# Altium schematic sheet electronic_dc_load_v1.SchDoc: Electronic DC Load (part 2 of 3)
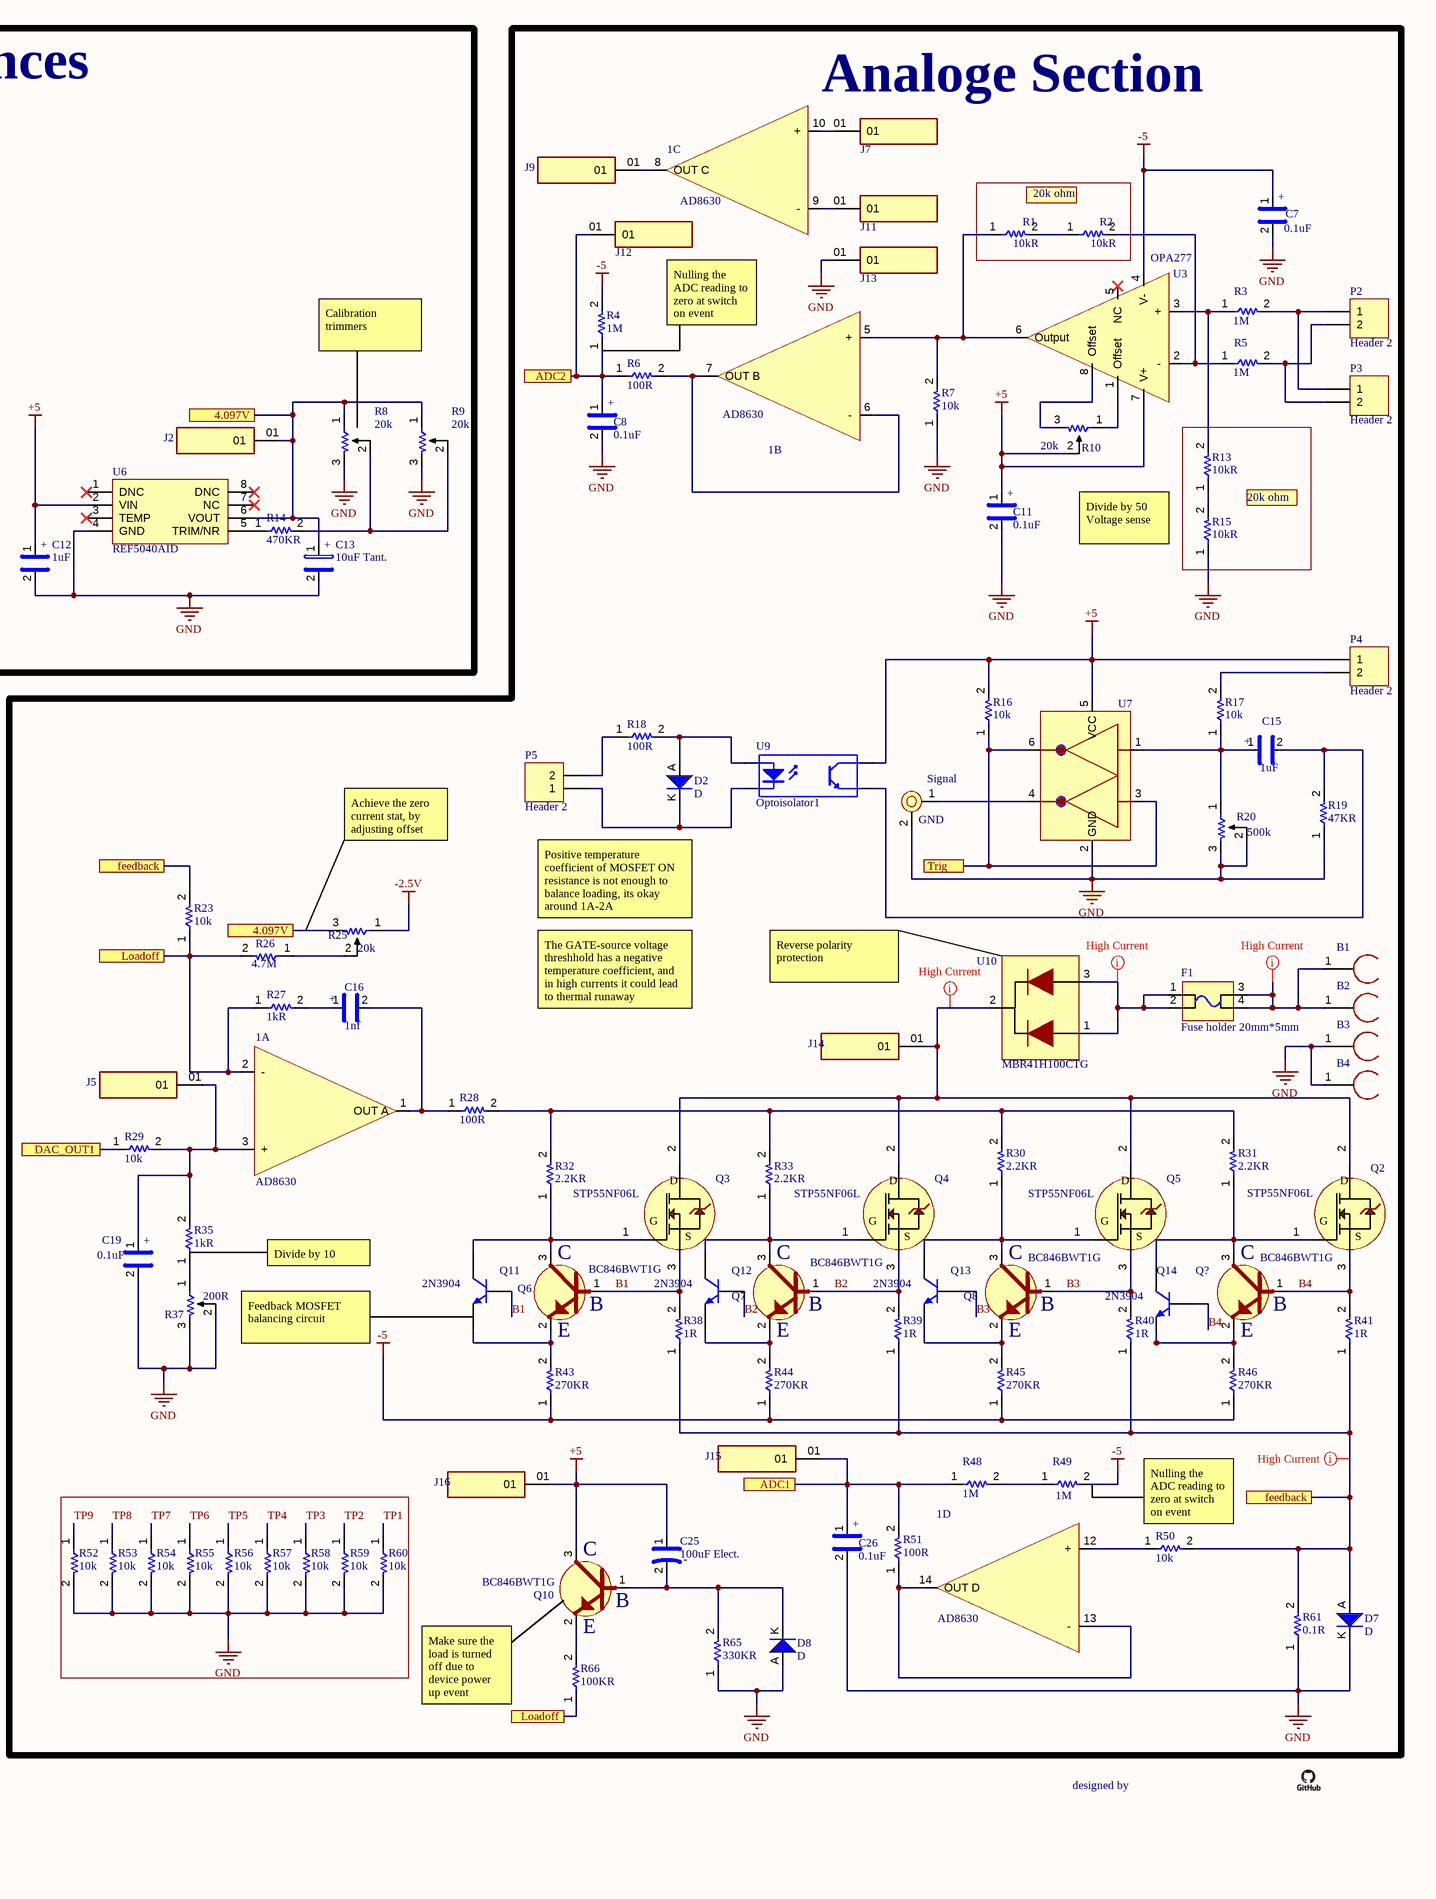
[diagram p2: electronic_dc_load_v1.SchDoc, right]
## Library data of the parts
1 = AD8630: ANALOG DEVICES - AD8630ARUZ - Operational Amplifier, Quad, 4 Amplifier, 2.5 MHz, 1 V/µs, 2.7V to 5V, TSSOP, 14 Pins; Gain Bandwidth Product: 2.5MHz; Max Dual Supply Voltage: 2.5V; Min Dual Supply Voltage: 1.35V; Voltage Gain: 145dB; Number of Channels: 4; Common Mode Rejection Ratio: 140dB; Slew Rate: 1V/µs; Input Bias Current: 100pA; Input Offset Voltage (Vos): 2.5uV; Operating Supply Current: 4.4mA; Output Current per Channel: 30mA; Power Supply Rejection Ratio (PSRR): 130dB; Operating Supply Voltage: 3V; Quiescent Current: 1.1mA; Input Capacitance: 10pF; Supplier 1: Newark; Manufacturer: Analog Devices; Manufacturer Part Number: AD8630ARUZ; RoHS: Yes; Category: Amplifiers - Op Amps, Buffer, Instrumentation; Case/Package: TSSOP; Number of Pins: 14; Contact Plating: Tin,Matte; Min Operating Temperature: -40°C; Max Operating Temperature: 125°C; Min Supply Voltage: 2.7V; Max Supply Voltage: 5V; Unity Gain Bandwidth Product: 2.5MHz; Packaging: Rail/Tube; Package Quantity: 96; Number of Circuits: 4; Number of Elements: 4; Number of Amplifiers: 4; -3db Bandwidth: 2.5MHz; Series: -; Bandwidth: 2.5MHz; Max Supply Current: 4.4mA; Length: 5mm; Width: 4.4mm; Height: 1mm; Radiation Hardening: No; Lead Free: Contains Lead; RoHS Compliant: Yes; REACH SVHC: No SVHC; ComponentLink1URL: https://datasheet.ciiva.com/15130/getdatasheetpartid-63998-15130068.pdf?src-supplier=Verical; ComponentLink1Description: https://datasheet.ciiva.com/15130/getdatasheetpartid-63998-15130068.pdf?src-supplier=Verical; ComponentLink2URL: https://datasheet.ciiva.com/26849/ad8630aruz-26849452.pdf?src-supplier=IIIC; ComponentLink2Description: https://datasheet.ciiva.com/26849/ad8630aruz-26849452.pdf?src-supplier=IIIC; ComponentLink3URL: https://datasheet.ciiva.com/1795/ad8628-8629-8630-1795026.pdf?src-supplier=Digi-Key; ComponentLink3Description: https://datasheet.ciiva.com/1795/ad8628-8629-8630-1795026.pdf?src-supplier=Digi-Key; ComponentLink4URL: https://datasheet.ciiva.com/2976/ad8628-8629-8630-2976039.pdf?src-supplier=Avnet; ComponentLink4Description: https://datasheet.ciiva.com/2976/ad8628-8629-8630-2976039.pdf?src-supplier=Avnet; ComponentLink5URL: https://datasheet.ciiva.com/15374/ad8628-8629-8630-249176-15374283.pdf?src-supplier=Mouser; ComponentLink5Description: https://datasheet.ciiva.com/15374/ad8628-8629-8630-249176-15374283.pdf?src-supplier=Mouser; ComponentLink6URL: https://datasheet.ciiva.com/1135/1852416-1135902.pdf?src-supplier=Element14; ComponentLink6Description: https://datasheet.ciiva.com/1135/1852416-1135902.pdf?src-supplier=Element14; ComponentLink7URL: https://datasheet.ciiva.com/48710/001249419-da-01-en-ic-opamp-chopper-ad8630aruz-tssop-14-adi-48710044.pdf?src-supplier=Conrad; ComponentLink7Description: https://datasheet.ciiva.com/48710/001249419-da-01-en-ic-opamp-chopper-ad8630aruz-tssop-14-adi-48710044.pdf?src-supplier=Conrad; Supplier Part Number 1: 19M0982
4 = 031-71052: Connector; RF; BNC; Rt. Angle; PCB Jack; Bulkhead Mnt; 75 Ohm; Nickel/Gold; Manufacturer: Amphenol; Body Material: Zinc; Body Plating: Nickel; Dielectric Material: PBT; Frequency: 1GHz; Impedance: 75R; Connector Type: BNC,Socket; Voltage Rating: 500V; Supplier 1: Digi-Key; Manufacturer Part Number: 031-71052; RoHS: Yes; Category: RF / Coaxial Connectors; Stock 1: 160; Pricing 1: 1=3.33000, 10=3.20000, 25=2.93320, 50=2.79980, 100=2.66640, 250=2.33312, 500=2.26644, 1000=1.93314, 2500=1.79982 (USD); Mount: Through Hole,Panel,Bulkhead,PCB; Contact Material: Bronze,Copper; Contact Plating: Gold; Housing Color: Silver; Min Operating Temperature: -55°C; Max Operating Temperature: 85°C; Termination: Solder; Packaging: Bulk; Orientation: Right Angle; Max Frequency: 1GHz; Package Quantity: 100; Fastening Type: Bayonet; Radiation Hardening: No; ComponentLink1URL: https://datasheet.ciiva.com/29191/c031-71052-29191970.pdf?src-supplier=Digi-Key; ComponentLink1Description: https://datasheet.ciiva.com/29191/c031-71052-29191970.pdf?src-supplier=Digi-Key; ComponentLink2URL: https://datasheet.ciiva.com/14568/70142399-14568714.pdf?src-supplier=Allied+Electronics; ComponentLink2Description: https://datasheet.ciiva.com/14568/70142399-14568714.pdf?src-supplier=Allied+Electronics; Supplier Part Number 1: ARF2869-ND
C1 = 47μF: 47μF 16V  electrolytic
C2 = 470μF: 35V electrolytic
C3-C5 C7-C9 C11 C17 C19 C26 = 0.1uF: CAPACITOR PEN FILM 0.1UF, 100V, 10%, 1812, FULL REEL; Product Range:AEC-Q200 LDE Series; Capacitance:0.1 F; Capacitance Tolerance: 10%; Capacitor Dielectric Type:PEN (Polyethylene Naphthalate); Voltage Rating:100V; Lead Spacing:- ;RoHS Compliant: Yes; Manufacturer: KEMET; Manufacturer Part Number: LDEEC3100KA5N00; Dielectric Material: Polyester; Capacitance: 100nF; Voltage Rating (AC): 63V; Dissipation Factor: 0.8%; Supplier 1: Digi-Key; RoHS: Yes; Category: Film Capacitors; Stock 1: 2950; Pricing 1: 1=0.88000, 10=0.66600, 50=0.55300, 100=0.47620, 500=0.36868, 1000=0.31747 (USD); Mount: Surface Mount,PCB; Case/Package: 1812; Number of Pins: 2; Case Code (Metric): 4532; Case Code (Imperial): 1812; Min Operating Temperature: -55°C; Max Operating Temperature: 125°C; Tolerance: 10%; Package Quantity: 1; Voltage Rating: 100V; Voltage Rating (DC): 100V; Packaging: Tape and Reel; Termination: SMD/SMT; Voltage: 100V; Series: LDE; Construction: Flat; Length: 4.7mm; Width: 3.2mm; Height: 2.4mm; Height - Seated (Max): 0.094inch; Depth: 3.3mm; Radiation Hardening: No; REACH SVHC: No SVHC; RoHS Compliant: Yes; ComponentLink1URL: https://datasheet.ciiva.com/17238/datasheetpn-ldeec3100ka5n00-17238771.pdf?src-supplier=Avnet+Europe; ComponentLink1Description: https://datasheet.ciiva.com/17238/datasheetpn-ldeec3100ka5n00-17238771.pdf?src-supplier=Avnet+Europe; Supplier Part Number 1: 399-5480-1-ND
C6 = 220μF: 220μF 25V  electrolytic
C10 C18 C20 C23-C25 = 100uF Elect.: CAP ALUM 100UF 20% 50V SMD electrolytic; Manufacturer: KEMET; Manufacturer Part Number: EDK107M050A9MAA; Ripple Current: 165mA; Leakage Current: 50uA; Life (Hours): 2000Hour; Dissipation Factor: 12%; Supplier 1: Digi-Key; RoHS: Yes; Category: Aluminum Electrolytic Capacitors; Stock 1: 2832; Pricing 1: 1=0.74000, 10=0.52100, 50=0.39420, 100=0.34340 (USD); Mount: Surface Mount; Case/Package: Radial; Min Operating Temperature: -40°C; Max Operating Temperature: 85°C; Capacitance: 100uF; Tolerance: 20%; Package Quantity: 500; Voltage Rating: 50V; Packaging: Cut Tape; Voltage Rating (DC): 50V; Ripple Current (AC): 165mA; Termination: SMD/SMT; Series: EDK; Construction: Cylindrical; Diameter: 8mm; Length: 10.2mm; Height: 10.2mm; Height - Seated (Max): 0.413inch; Radiation Hardening: No; REACH SVHC: No SVHC; RoHS Compliant: Yes; ComponentLink1URL: https://datasheet.ciiva.com/5363/kem-a4001-edk-535350-5363820.pdf?src-supplier=Mouser; ComponentLink1Description: https://datasheet.ciiva.com/5363/kem-a4001-edk-535350-5363820.pdf?src-supplier=Mouser; ComponentLink2URL: https://datasheet.ciiva.com/8032/1680956-8032398.pdf?src-supplier=Element14; ComponentLink2Description: https://datasheet.ciiva.com/8032/1680956-8032398.pdf?src-supplier=Element14; Supplier Part Number 1: 399-6672-1-ND
C12 C15 = 1uF: CAP TANT 1UF 35V 10% 1206; Manufacturer: Kyocera AVX; Manufacturer Part Number: TPSA105K035R3000; Dielectric Material: Tantalum; ESR (Equivalent Series Resistance): 3R; Ripple Current: 63uA; Leakage Current: 500nA; Polarity: Polar; Dissipation Factor: 4%; Supplier 1: Digi-Key; RoHS: Yes; Category: Tantalum Capacitors; Stock 1: 11457; Pricing 1: 1=0.57000, 10=0.40600, 50=0.30680, 100=0.26730, 500=0.19800, 1000=0.16830 (USD); Mount: Surface Mount,PCB; Case/Package: 1206; Number of Pins: 2; Case Code (Imperial): 1206; Case Code (Metric): 3216; Min Operating Temperature: -55°C; Max Operating Temperature: 125°C; Capacitance: 1uF; Package Quantity: 1; Voltage Rating: 35V; Tolerance: 10%; Packaging: Tape and Reel; Voltage Rating (DC): 35V; Termination: SMD/SMT; Voltage: 35V; Features: General Purpose; Series: TPS; Construction: Flat; Length: 3.2mm; Width: 1.6mm; Height: 1.6mm; Height - Seated (Max): 0.071inch; Depth: 1.6mm; Radiation Hardening: No; REACH SVHC: No SVHC; Lead Free: Lead Free; RoHS Compliant: Yes; ComponentLink1URL: https://datasheet.ciiva.com/11794/0900766b8070be5f-11794565.pdf?src-supplier=RSComponents; ComponentLink1Description: https://datasheet.ciiva.com/11794/0900766b8070be5f-11794565.pdf?src-supplier=RSComponents; ComponentLink2URL: https://datasheet.ciiva.com/263/tps-263817.pdf?src-supplier=Digi-Key; ComponentLink2Description: https://datasheet.ciiva.com/263/tps-263817.pdf?src-supplier=Digi-Key; ComponentLink3URL: https://datasheet.ciiva.com/7832/1680477-7832618.pdf?src-supplier=Element14; ComponentLink3Description: https://datasheet.ciiva.com/7832/1680477-7832618.pdf?src-supplier=Element14; ComponentLink4URL: https://datasheet.ciiva.com/7832/1441576-7832619.pdf?src-supplier=Element14; ComponentLink4Description: https://datasheet.ciiva.com/7832/1441576-7832619.pdf?src-supplier=Element14; ComponentLink5URL: https://datasheet.ciiva.com/7832/1441576-7832620.pdf?src-supplier=Element14; ComponentLink5Description: https://datasheet.ciiva.com/7832/1441576-7832620.pdf?src-supplier=Element14; ComponentLink6URL: https://datasheet.ciiva.com/14602/70001047-14602621.pdf?src-supplier=Allied+Electronics; ComponentLink6Description: https://datasheet.ciiva.com/14602/70001047-14602621.pdf?src-supplier=Allied+Electronics; ComponentLink7URL: https://datasheet.ciiva.com/14598/70001047-14598933.pdf?src-supplier=Allied+Electronics; ComponentLink7Description: https://datasheet.ciiva.com/14598/70001047-14598933.pdf?src-supplier=Allied+Electronics; ComponentLink8URL: https://datasheet.ciiva.com/263/tps-263816.pdf?src-supplier=Digi-Key; ComponentLink8Description: https://datasheet.ciiva.com/263/tps-263816.pdf?src-supplier=Digi-Key; ComponentLink9URL: https://datasheet.ciiva.com/263/tps-263818.pdf?src-supplier=Digi-Key; ComponentLink9Description: https://datasheet.ciiva.com/263/tps-263818.pdf?src-supplier=Digi-Key; ComponentLink10URL: https://datasheet.ciiva.com/46438/packmark-46438479.pdf?src-supplier=Element14; ComponentLink10Description: https://datasheet.ciiva.com/46438/packmark-46438479.pdf?src-supplier=Element14; Supplier Part Number 1: 478-3336-1-ND
C13 = 10uF Tant.: AVX   TPSC106K025R0500...   CAPACITOR, CASE C, 10UF, 25V; Manufacturer: Kyocera AVX; Dielectric Material: Tantalum; Tolerance: 10%; ESR (Equivalent Series Resistance): 500mR; Leakage Current: 2.5uA; Dissipation Factor: 6%; Polarity: Polar; Supplier 1: Digi-Key; Manufacturer Part Number: TPSC106K025R0500; RoHS: Yes; Category: Tantalum Capacitors; Stock 1: 8068; Pricing 1: 1=0.88000, 10=0.66600, 50=0.55360, 100=0.47660 (USD); Mount: Surface Mount,PCB; Case/Package: Molded; Number of Pins: 2; Case Code (Imperial): 2312; Case Code (Metric): 6032; Min Operating Temperature: -55°C; Max Operating Temperature: 125°C; Capacitance: 10uF; Packaging: Tape and Reel; Voltage Rating: 25V; Voltage Rating (DC): 25V; Package Quantity: 1; Termination: SMD/SMT; Voltage: 25V; Features: General Purpose; Series: TPS; Construction: Flat; Length: 6mm; Width: 3.2mm; Height: 2.6mm; Height - Seated (Max): 0.11inch; Depth: 3.2mm; Size: 2.6mm; Radiation Hardening: No; REACH SVHC: No SVHC; Lead Free: Lead Free; RoHS Compliant: Yes; ComponentLink1URL: https://datasheet.ciiva.com/19458/2025244-19458872.pdf?src-supplier=Jameco; ComponentLink1Description: https://datasheet.ciiva.com/19458/2025244-19458872.pdf?src-supplier=Jameco; ComponentLink2URL: https://datasheet.ciiva.com/29121/806610-da-01-en-smd-tantal10uf-25v-10-0-500r-500st-29121571.pdf?src-supplier=Conrad; ComponentLink2Description: https://datasheet.ciiva.com/29121/806610-da-01-en-smd-tantal10uf-25v-10-0-500r-500st-29121571.pdf?src-supplier=Conrad; ComponentLink3URL: https://datasheet.ciiva.com/12911/tps-23028-12911431.pdf?src-supplier=Mouser; ComponentLink3Description: https://datasheet.ciiva.com/12911/tps-23028-12911431.pdf?src-supplier=Mouser; ComponentLink4URL: https://datasheet.ciiva.com/7730/1441576-7730890.pdf?src-supplier=Element14; ComponentLink4Description: https://datasheet.ciiva.com/7730/1441576-7730890.pdf?src-supplier=Element14; ComponentLink5URL: https://datasheet.ciiva.com/7730/1755837-7730891.pdf?src-supplier=Element14; ComponentLink5Description: https://datasheet.ciiva.com/7730/1755837-7730891.pdf?src-supplier=Element14; ComponentLink6URL: https://datasheet.ciiva.com/264/tps-264284.pdf?src-supplier=Digi-Key; ComponentLink6Description: https://datasheet.ciiva.com/264/tps-264284.pdf?src-supplier=Digi-Key; ComponentLink7URL: https://datasheet.ciiva.com/7730/1755837-7730892.pdf?src-supplier=Element14; ComponentLink7Description: https://datasheet.ciiva.com/7730/1755837-7730892.pdf?src-supplier=Element14; ComponentLink8URL: https://datasheet.ciiva.com/264/tps-264285.pdf?src-supplier=Digi-Key; ComponentLink8Description: https://datasheet.ciiva.com/264/tps-264285.pdf?src-supplier=Digi-Key; ComponentLink9URL: https://datasheet.ciiva.com/7730/1441576-7730893.pdf?src-supplier=Element14; ComponentLink9Description: https://datasheet.ciiva.com/7730/1441576-7730893.pdf?src-supplier=Element14; ComponentLink10URL: https://datasheet.ciiva.com/22746/1441576-22746493.pdf?src-supplier=Element14; ComponentLink10Description: https://datasheet.ciiva.com/22746/1441576-22746493.pdf?src-supplier=Element14; ComponentLink11URL: https://datasheet.ciiva.com/3004/tps-3004613.pdf?src-supplier=Avnet; ComponentLink11Description: https://datasheet.ciiva.com/3004/tps-3004613.pdf?src-supplier=Avnet; ComponentLink12URL: https://datasheet.ciiva.com/7730/1680477-7730889.pdf?src-supplier=Element14; ComponentLink12Description: https://datasheet.ciiva.com/7730/1680477-7730889.pdf?src-supplier=Element14; ComponentLink13URL: https://datasheet.ciiva.com/18710/tps-eng-18710601.pdf?src-supplier=Distrelec; ComponentLink13Description: https://datasheet.ciiva.com/18710/tps-eng-18710601.pdf?src-supplier=Distrelec; Supplier Part Number 1: 478-1762-1-ND
C14 C27 C28 = 100uF Tant.: AVX - TPSE107K020R0150 - Surface Mount Tantalum Capacitor, 100 &#181;F, 20 V, 2917 [7343 Metric], TPS Series, &#177; 10%, -55 &#176;C; Manufacturer: Kyocera AVX; ESR (Equivalent Series Resistance): 150mR; Voltage Rating: 20V; Ripple Current: 420uA; Leakage Current: 20uA; Polarity: Polar; Dissipation Factor: 6%; Supplier 1: Digi-Key; Manufacturer Part Number: TPSE107K020R0150; RoHS: Yes; Category: Tantalum Capacitors; Stock 1: 680; Pricing 1: 1=1.87000, 10=1.51200, 50=1.32000, 100=1.15500 (USD); Mount: Surface Mount,PCB; Case/Package: 2917; Case Code (Metric): 7343; Case Code (Imperial): 2917; Weight: 0.023634oz; Dielectric Material: Tantalum; Min Operating Temperature: -55°C; Max Operating Temperature: 125°C; Capacitance: 100uF; Tolerance: 10%; Voltage Rating (DC): 20V; Packaging: Tape and Reel; Package Quantity: 1; Termination: SMD/SMT; Voltage: 20V; Features: General Purpose; Series: TPS; Construction: Flat; Length: 7.3mm; Width: 4.3mm; Height: 4.1mm; Depth: 4.3mm; Height - Seated (Max): 0.169inch; Radiation Hardening: No; REACH SVHC: No SVHC; Lead Free: Lead Free; RoHS Compliant: Yes; ComponentLink1URL: https://datasheet.ciiva.com/26944/getdatasheetpartid-140515-26944833.pdf?src-supplier=Verical; ComponentLink1Description: https://datasheet.ciiva.com/26944/getdatasheetpartid-140515-26944833.pdf?src-supplier=Verical; ComponentLink2URL: https://datasheet.ciiva.com/36178/2038926-36178963.pdf?src-supplier=Jameco; ComponentLink2Description: https://datasheet.ciiva.com/36178/2038926-36178963.pdf?src-supplier=Jameco; ComponentLink3URL: https://datasheet.ciiva.com/11794/0900766b80962b61-11794582.pdf?src-supplier=RSComponents; ComponentLink3Description: https://datasheet.ciiva.com/11794/0900766b80962b61-11794582.pdf?src-supplier=RSComponents; ComponentLink4URL: https://datasheet.ciiva.com/29121/806605-da-01-en-smd-tantal100uf-20v-10-0-150r-400st-29121566.pdf?src-supplier=Conrad; ComponentLink4Description: https://datasheet.ciiva.com/29121/806605-da-01-en-smd-tantal100uf-20v-10-0-150r-400st-29121566.pdf?src-supplier=Conrad; ComponentLink5URL: https://datasheet.ciiva.com/265/tps-265429.pdf?src-supplier=Digi-Key; ComponentLink5Description: https://datasheet.ciiva.com/265/tps-265429.pdf?src-supplier=Digi-Key; ComponentLink6URL: https://datasheet.ciiva.com/265/tps-265430.pdf?src-supplier=Digi-Key; ComponentLink6Description: https://datasheet.ciiva.com/265/tps-265430.pdf?src-supplier=Digi-Key; ComponentLink7URL: https://datasheet.ciiva.com/12911/tps-23028-12911414.pdf?src-supplier=Mouser; ComponentLink7Description: https://datasheet.ciiva.com/12911/tps-23028-12911414.pdf?src-supplier=Mouser; ComponentLink8URL: https://datasheet.ciiva.com/265/tps-265431.pdf?src-supplier=Digi-Key; ComponentLink8Description: https://datasheet.ciiva.com/265/tps-265431.pdf?src-supplier=Digi-Key; ComponentLink9URL: https://datasheet.ciiva.com/11231/tps-11231351.pdf?src-supplier=Avnet; ComponentLink9Description: https://datasheet.ciiva.com/11231/tps-11231351.pdf?src-supplier=Avnet; ComponentLink10URL: https://datasheet.ciiva.com/14609/70001047-14609387.pdf?src-supplier=Allied+Electronics; ComponentLink10Description: https://datasheet.ciiva.com/14609/70001047-14609387.pdf?src-supplier=Allied+Electronics; ComponentLink11URL: https://datasheet.ciiva.com/16501/tps-16501660.pdf?src-supplier=Future+Electronics; ComponentLink11Description: https://datasheet.ciiva.com/16501/tps-16501660.pdf?src-supplier=Future+Electronics; ComponentLink12URL: https://datasheet.ciiva.com/7720/1680477-7720766.pdf?src-supplier=Element14; ComponentLink12Description: https://datasheet.ciiva.com/7720/1680477-7720766.pdf?src-supplier=Element14; ComponentLink13URL: https://datasheet.ciiva.com/7720/1680477-7720767.pdf?src-supplier=Element14; ComponentLink13Description: https://datasheet.ciiva.com/7720/1680477-7720767.pdf?src-supplier=Element14; ComponentLink14URL: https://datasheet.ciiva.com/14591/70001047-14591823.pdf?src-supplier=Allied+Electronics; ComponentLink14Description: https://datasheet.ciiva.com/14591/70001047-14591823.pdf?src-supplier=Allied+Electronics; Supplier Part Number 1: 478-1795-1-ND
C16 = 1nf: CAP FILM 1000PF 5% 100VDC RADIAL; Manufacturer: KEMET; Dielectric Material: Polyester; Voltage Rating (DC): 100V; Voltage Rating (AC): 63V; Dielectric: PET; Dissipation Factor: 80%; Insulation Resistance: 30R; Type: General Purpose; Lead Diameter: 0.5mm; Supplier 1: Digi-Key; Manufacturer Part Number: R82EC1100AA50J; RoHS: Yes; Category: Film Capacitors; Stock 1: 3; Pricing 1: 1=0.22000, 10=0.14800, 50=0.09880, 100=0.08400, 500=0.05928, 1000=0.05187, 2500=0.04940, 5000=0.04570 (USD); Mount: Through Hole,PCB; Case/Package: Radial; Min Operating Temperature: -55°C; Max Operating Temperature: 105°C; Capacitance: 1nF; Packaging: Bulk; Tolerance: 5%; Package Quantity: 3000; Voltage Rating: 100V; Termination: Radial; Voltage: 100V; Series: R82; Construction: RADIAL; Length: 7.2mm; Width: 2.5mm; Height: 6.5mm; Lead Pitch: 5mm; Height - Seated (Max): 0.26inch; Depth: 2.5mm; Ratings: AEC-Q200; Radiation Hardening: No; RoHS Compliant: Yes; ComponentLink1URL: https://datasheet.ciiva.com/13404/kem-f3101-r82-540827-13404565.pdf?src-supplier=Mouser; ComponentLink1Description: https://datasheet.ciiva.com/13404/kem-f3101-r82-540827-13404565.pdf?src-supplier=Mouser; Supplier Part Number 1: 399-5871-ND
C21 C22 = 22pF: CAP CER 22PF 50V C0G/NP0 1210; Manufacturer: Wurth Electronics; Manufacturer Part Number: 885012009007; Tolerance: 5%; Supplier 1: Digi-Key; RoHS: Yes; Category: Ceramic Capacitors; Stock 1: 854; Pricing 1: 1=0.60000, 10=0.54500, 100=0.48860, 500=0.43222, 1000=0.27160 (USD); Mount: Surface Mount; Case/Package: 1210; Case Code (Metric): 3225; Case Code (Imperial): 1210; Min Operating Temperature: -55°C; Max Operating Temperature: 125°C; Packaging: Tape and Reel; Capacitance: 22pF; Voltage Rating: 50V; Length: 0.126inch; Width: 0.098inch; Thickness: 0.041inch; RoHS Compliant: Yes; ComponentLink1URL: https://katalog.we-online.de/pbs/datasheet/885012009007.pdf?src-supplier=Digi-Key; ComponentLink1Description: https://katalog.we-online.de/pbs/datasheet/885012009007.pdf?src-supplier=Digi-Key; Supplier Part Number 1: 732-7599-1-ND
D1 = 15-21SURC/S530-A3/TR8: Standard LEDs - SMD SMD LED; Manufacturer: Everlight; Color: Red; Lens Color: Colorless; Luminous Intensity: 54mcd; Viewing Angle: 140°; Forward Current: 20mA; Forward Voltage: 2V; Lens Style: Diffused,Colorless,Rectangular,Clear; Power Rating: 60mW; Dominant Wavelength: 624nm; Lens Transparency: Clear; Number of Elements: 1; Reverse Voltage: 5V; Supplier 1: Mouser; Manufacturer Part Number: 15-21SURC/S530-A3/TR8; RoHS: Yes; Category: LEDs; Stock 1: 1500; Pricing 1: 1=0.38000, 10=0.20300, 50=0.20300, 100=0.10700, 1000=0.07200, 10000=0.04800 (USD); Mount: Surface Mount; Case/Package: 1206; Number of Pins: 2; Min Operating Temperature: -40°C; Max Operating Temperature: 85°C; Packaging: Tape and Reel; Package Quantity: 2000; Illumination Color: Red; Test Current: 20mA; Power Dissipation: 60mW; Number of LEDs: 1; Max Power Dissipation: 60mW; Series: -; Length: 3.2mm; Width: 1.5mm; Height: 1mm; Depth: 1.5mm; Radiation Hardening: No; Lead Free: Lead Free; RoHS Compliant: Yes; ComponentLink1URL: https://datasheet.ciiva.com/16397/1239103534-9274-16397709.pdf?src-supplier=Future+Electronics; ComponentLink1Description: https://datasheet.ciiva.com/16397/1239103534-9274-16397709.pdf?src-supplier=Future+Electronics; ComponentLink2URL: https://datasheet.ciiva.com/14182/07531189-14182654.pdf?src-supplier=Distrelec; ComponentLink2Description: https://datasheet.ciiva.com/14182/07531189-14182654.pdf?src-supplier=Distrelec; ComponentLink3URL: https://datasheet.ciiva.com/2119/15-21surc-s530-xx-tr8-2119437.pdf?src-supplier=Digi-Key; ComponentLink3Description: https://datasheet.ciiva.com/2119/15-21surc-s530-xx-tr8-2119437.pdf?src-supplier=Digi-Key; ComponentLink4URL: https://datasheet.ciiva.com/12401/1521surcs530a3tr8-195649-12401374.pdf?src-supplier=Mouser; ComponentLink4Description: https://datasheet.ciiva.com/12401/1521surcs530a3tr8-195649-12401374.pdf?src-supplier=Mouser; ComponentLink5URL: https://datasheet.ciiva.com/26925/getdatasheetpartid-761151-26925787.pdf?src-supplier=Verical; ComponentLink5Description: https://datasheet.ciiva.com/26925/getdatasheetpartid-761151-26925787.pdf?src-supplier=Verical; Supplier Part Number 1: 638-1521SURCS530A3
D2-D8 = D: Manufacturer: Taiwan Semiconductor; Manufacturer Part Number: MMBD4148 RFG; Supplier 1: Mouser; RoHS: Yes; Stock 1: 5996; Pricing 1: 1=0.22000, 10=0.19000, 50=0.19000, 100=0.12600, 1000=0.04200, 10000=0.02700 (USD); RoHS Compliant: Yes; Supplier Part Number 1: 821-MMBD4148RFG
J1 = Power jack: KLDHCX-0202-AC-1; Manufacturer: Kycon; Supplier 1: Digi-Key; Manufacturer Part Number: KLDHCX-0202-AC-1; RoHS: No; Stock 1: 484; Pricing 1: 1=0.82000, 10=0.71900, 25=0.67680, 50=0.64860, 100=0.62040, 250=0.56400, 500=0.50760, 1000=0.45120, 2500=0.40890 (USD); Supplier Part Number 1: 2092-KLDHCX-0202-AC-1-ND
J2-J16 = TSW-101-24-T-S: MF: {'manufacturer': u'Samtec'}; Value: *; Price: None; Availability: Unavailable; Package: None; MP: TSW-101-24-T-S
P1 = Header 2H: Header, 2-Pin, Right Angle; LatestRevisionDate: 17-Jul-2002; LatestRevisionNote: Re-released for DXP Platform.; Publisher: Altium Limited
P2-P6 = Header 2: Header, 2-Pin; LatestRevisionDate: 17-Jul-2002; LatestRevisionNote: Re-released for DXP Platform.; Publisher: Altium Limited
P7 = Header 6: Header, 6-Pin; LatestRevisionDate: 17-Jul-2002; LatestRevisionNote: Re-released for DXP Platform.; Publisher: Altium Limited
P8 = Header 7: Header, 7-Pin; LatestRevisionDate: 17-Jul-2002; LatestRevisionNote: Re-released for DXP Platform.; Publisher: Altium Limited
Q1-Q5 = STP55NF06L: POWER MOSFET; Manufacturer: STMicroelectronics; Rise Time: 100ns; Continuous Drain Current (ID): 55A; Turn-Off Delay Time: 40ns; Turn-On Delay Time: 20ns; Gate to Source Voltage (Vgs): 16V; Rds On Max: 18mR; Input Capacitance: 1.7nF; Number of Elements: 1; Max Power Dissipation: 95W; Nominal Vgs: 1.7V; Drain to Source Voltage (Vdss): 60V; Drain to Source Resistance: 14mR; Element Configuration: Single; Polarity: N-CHANNEL; Supplier 1: Digi-Key; Manufacturer Part Number: STP55NF06L; RoHS: Yes; Category: MOSFETs; Stock 1: 1903; Pricing 1: 1=1.73000, 10=1.55200, 25=1.46440, 100=1.24760, 500=1.02506, 1000=0.93188 (USD); Mount: Through Hole; Case/Package: TO-220; Number of Pins: 3; Weight: 0.01lb; Min Operating Temperature: -55°C; Max Operating Temperature: 175°C; Package Quantity: 50; Packaging: Rail/Tube; Drain to Source Breakdown Voltage: 60V; Fall Time: 20ns; Power Dissipation: 95W; Threshold Voltage: 1.7V; Voltage Rating (DC): 60V; Current Rating: 55A; On-State Resistance: 18mR; Series: STripFET™; Drain-source On Resistance-Max: 18mR; Length: 10.4mm; Width: 4.6mm; Height: 9.15mm; Radiation Hardening: No; RoHS Compliant: Yes; REACH SVHC: No SVHC; Lead Free: Lead Free; ComponentLink1URL: https://datasheet.ciiva.com/938/cd00002690-938896.pdf?src-supplier=Digi-Key; ComponentLink1Description: https://datasheet.ciiva.com/938/cd00002690-938896.pdf?src-supplier=Digi-Key; ComponentLink2URL: https://datasheet.ciiva.com/22655/129279-22655977.pdf?src-supplier=Element14; ComponentLink2Description: https://datasheet.ciiva.com/22655/129279-22655977.pdf?src-supplier=Element14; ComponentLink3URL: https://datasheet.ciiva.com/16286/cd00002690-16286844.pdf?src-supplier=Future+Electronics; ComponentLink3Description: https://datasheet.ciiva.com/16286/cd00002690-16286844.pdf?src-supplier=Future+Electronics
  Q2-Q5: Supplier Part Number 1: 497-6742-5-ND
Q6-Q8 Q10 Q? = BC846BWT1G: ON SEMICONDUCTOR - BC846BWT1G - Bipolar (BJT) Single Transistor, General Purpose, NPN, 65 V, 100 MHz, 150 mW, 100 mA, 100 hFE; Max Power Dissipation: 150mW; Number of Elements: 1; Frequency: 100MHz; Collector Emitter Voltage (VCEO): 65V; Max Collector Current: 100mA; Collector Base Voltage (VCBO): 80V; Emitter Base Voltage (VEBO): 6V; Collector Emitter Saturation Voltage: 600mV; hFE Min: 150; Supplier 1: Digi-Key; Manufacturer: ON Semiconductor; Manufacturer Part Number: BC846BWT1G; RoHS: Yes; Category: BJTs; Stock 1: 15423; Pricing 1: 1=0.14000, 10=0.13200, 25=0.12600, 100=0.07200, 500=0.04430, 1000=0.03021 (USD); Case/Package: SC; Number of Pins: 3; Contact Plating: Tin,Matte; Min Operating Temperature: -55°C; Max Operating Temperature: 150°C; Package Quantity: 1; Packaging: Tape and Reel; Transition Frequency: 100MHz; Collector Emitter Breakdown Voltage: 65V; Max Breakdown Voltage: 65V; Polarity: NPN; Power Dissipation: 150mW; Element Configuration: Single; Gain Bandwidth Product: 100MHz; Series: -; Collector-emitter Voltage-Max: 600mV; Max Frequency: 100MHz; Voltage Rating (DC): 65V; Current Rating: 100mA; Length: 2.2mm; Width: 1.35mm; Height: 0.9mm; Radiation Hardening: No; REACH SVHC: No SVHC; Lead Free: Lead Free; Halogen Free: Halogen Free; RoHS Compliant: Yes; ComponentLink1URL: https://datasheet.ciiva.com/1261/bc846awt1-d-1261088.pdf?src-supplier=Newark; ComponentLink1Description: https://datasheet.ciiva.com/1261/bc846awt1-d-1261088.pdf?src-supplier=Newark; ComponentLink2URL: https://datasheet.ciiva.com/30480/0900766b812769a2-30480624.pdf?src-supplier=RSComponents; ComponentLink2Description: https://datasheet.ciiva.com/30480/0900766b812769a2-30480624.pdf?src-supplier=RSComponents; ComponentLink3URL: https://datasheet.ciiva.com/15139/getdatasheetpartid-110048-15139274.pdf?src-supplier=Verical; ComponentLink3Description: https://datasheet.ciiva.com/15139/getdatasheetpartid-110048-15139274.pdf?src-supplier=Verical; ComponentLink4URL: https://datasheet.ciiva.com/976/bc846awt1-d-976449.pdf?src-supplier=Digi-Key; ComponentLink4Description: https://datasheet.ciiva.com/976/bc846awt1-d-976449.pdf?src-supplier=Digi-Key; ComponentLink5URL: https://datasheet.ciiva.com/976/bc846awt1-d-976450.pdf?src-supplier=Digi-Key; ComponentLink5Description: https://datasheet.ciiva.com/976/bc846awt1-d-976450.pdf?src-supplier=Digi-Key; ComponentLink6URL: https://datasheet.ciiva.com/976/bc846awt1-d-976451.pdf?src-supplier=Digi-Key; ComponentLink6Description: https://datasheet.ciiva.com/976/bc846awt1-d-976451.pdf?src-supplier=Digi-Key; ComponentLink7URL: https://datasheet.ciiva.com/11204/bc846awt1-d-11204342.pdf?src-supplier=Avnet; ComponentLink7Description: https://datasheet.ciiva.com/11204/bc846awt1-d-11204342.pdf?src-supplier=Avnet; ComponentLink8URL: https://datasheet.ciiva.com/11197/bc846awt1-d-11197543.pdf?src-supplier=Avnet; ComponentLink8Description: https://datasheet.ciiva.com/11197/bc846awt1-d-11197543.pdf?src-supplier=Avnet; ComponentLink9URL: https://datasheet.ciiva.com/25996/bc846awt1-d-25996743.pdf?src-supplier=Avnet+Europe; ComponentLink9Description: https://datasheet.ciiva.com/25996/bc846awt1-d-25996743.pdf?src-supplier=Avnet+Europe; ComponentLink10URL: https://datasheet.ciiva.com/22664/1907697-22664107.pdf?src-supplier=Element14; ComponentLink10Description: https://datasheet.ciiva.com/22664/1907697-22664107.pdf?src-supplier=Element14; Supplier Part Number 1: BC846BWT1GOSCT-ND
Q11-Q14 = 2N3904: NPN General Purpose Amplifier; Published: 8-Jun-2000; LatestRevisionDate: 15-Jan-2003; LatestRevisionNote: PCB Footprint 'BCY-W3/D4.7' replaced; DatasheetVersion: 1997; PackageVersion: Sep-1998; PackageReference: TO-92A; Publisher: Altium Limited; PackageDescription: TO, Flat Index; 3 In-Line, Axial Leads; Body Dia. 4.5mm; Leads 0.51 x 0.48 mm (max); ComponentLink1Description: Manufacturer Link; ComponentLink1URL: http://www.fairchildsemi.com/; ComponentLink2Description: Datasheet; ComponentLink2URL: http://www.fairchildsemi.com/ds/2N%2F2N3904.pdf
R1 R2 R13 R15 R36 R62-R64 = 10kR: RES SMD 10K OHM 1/4W 0604 WIDE; Manufacturer: Vishay; Manufacturer Part Number: MCW0406MD1002BP100; Power Rating: 250mW; Tolerance: 0.1%; Voltage Rating: 50V; Temperature Coefficient: 25ppm/°C; Supplier 1: Newark; RoHS: Yes; Category: Chip SMD Resistors; Pricing 1: 1000=0.44000 (USD); Case/Package: Molded; Case Code (Imperial): 0406; Contact Plating: Tin; Case Code (Metric): 1016; Min Operating Temperature: -55°C; Max Operating Temperature: 155°C; Resistance: 10kR; Packaging: Tape and Reel; Voltage Rating (DC): 50V; Resistor Type: Thin Film; Length: 1.6mm; Width: 1mm; Height: 0.3mm; Depth: 1.5mm; REACH SVHC: Unknown; Military Standard: Not; Lead Free: Lead Free; ComponentLink1URL: http://www.farnell.com/datasheets/2046107.pdf?src-supplier=Farnell; ComponentLink1Description: http://www.farnell.com/datasheets/2046107.pdf?src-supplier=Farnell; ComponentLink2URL: http://www.mouser.com/ds/2/427/mcw406atpre-111221.pdf?src-supplier=Mouser; ComponentLink2Description: http://www.mouser.com/ds/2/427/mcw406atpre-111221.pdf?src-supplier=Mouser; ComponentLink3URL: http://components.arrow.com/part/dataview/53344020S9999208N6892?src-supplier=Arrow+Electronics; ComponentLink3Description: http://components.arrow.com/part/dataview/53344020S9999208N6892?src-supplier=Arrow+Electronics; ComponentLink4URL: http://www.farnell.com/datasheets/2046107.pdf?src-supplier=Element14; ComponentLink4Description: http://www.farnell.com/datasheets/2046107.pdf?src-supplier=Element14; ComponentLink5URL: http://www.vishay.com/docs/28847/mcw406atpre.pdf?src-supplier=Digi-Key; ComponentLink5Description: http://www.vishay.com/docs/28847/mcw406atpre.pdf?src-supplier=Digi-Key; ComponentLink6URL: http://www.vishay.com/docs/28847/mcw406atpre.pdf?src-supplier=Avnet; ComponentLink6Description: http://www.vishay.com/docs/28847/mcw406atpre.pdf?src-supplier=Avnet; Supplier Part Number 1: 31W9016
R3-R5 R48 R49 = 1M: Res Thin Film 1206 1M Ohm 0.1% 0.25W(1/4W) ±25ppm/C Molded SMD Automotive Paper T/R; Manufacturer: Vishay Dale; Manufacturer Part Number: TNPW12061M00BEEA; Resistance: 1MR; Power Rating: 250mW; Voltage Rating: 200V; Temperature Coefficient: 25ppm/°C; Supplier 1: Digi-Key; RoHS: Yes; Category: Chip SMD Resistors; Stock 1: 47810; Pricing 1: 1=0.72000, 10=0.62700, 100=0.43700, 1000=0.25650, 2500=0.25270 (USD); Mount: Surface Mount; Case/Package: 1206; Case Code (Imperial): 1206; Case Code (Metric): 3216; Contact Plating: Tin; Size Code: 1206; Min Operating Temperature: -55°C; Max Operating Temperature: 125°C; Tolerance: 0.1%; Packaging: Tape and Reel; Package Quantity: 5000; Termination: SMD/SMT; Resistor Type: Thin Film; Number of Terminations: 2; Max Power Dissipation: 250mW; Voltage Rating (DC): 200V; Features: Moisture Resistant,Automotive AEC-Q200,Anti-Sulfur; Series: TNPW; Resistance Tolerance: 0.1%; Technology: THIN FILM; Construction: Rectangular; Length: 3.2mm; Width: 1.6mm; Height: 0.55mm; Depth: 1.6mm; Radiation Hardening: No; REACH SVHC: Unknown; Military Standard: Not; Lead Free: Lead Free; RoHS Compliant: Yes; ComponentLink1URL: https://datasheet.ciiva.com/2484/tnpw-e3-2484754.pdf?src-supplier=Digi-Key; ComponentLink1Description: https://datasheet.ciiva.com/2484/tnpw-e3-2484754.pdf?src-supplier=Digi-Key; ComponentLink2URL: https://datasheet.ciiva.com/2484/tnpw-e3-2484755.pdf?src-supplier=Digi-Key; ComponentLink2Description: https://datasheet.ciiva.com/2484/tnpw-e3-2484755.pdf?src-supplier=Digi-Key; ComponentLink3URL: https://datasheet.ciiva.com/2484/tnpw-e3-2484756.pdf?src-supplier=Digi-Key; ComponentLink3Description: https://datasheet.ciiva.com/2484/tnpw-e3-2484756.pdf?src-supplier=Digi-Key; ComponentLink4URL: https://datasheet.ciiva.com/22675/1599293-22675126.pdf?src-supplier=Element14; ComponentLink4Description: https://datasheet.ciiva.com/22675/1599293-22675126.pdf?src-supplier=Element14; ComponentLink5URL: https://datasheet.ciiva.com/16757/70201627-16757642.pdf?src-supplier=Allied+Electronics; ComponentLink5Description: https://datasheet.ciiva.com/16757/70201627-16757642.pdf?src-supplier=Allied+Electronics; ComponentLink6URL: https://datasheet.ciiva.com/46383/1599293-46383851.pdf?src-supplier=Element14; ComponentLink6Description: https://datasheet.ciiva.com/46383/1599293-46383851.pdf?src-supplier=Element14; Supplier Part Number 1: TNP1.00MACCT-ND
R6 R18 R28 R51 = 100R: 100Ω ±0.1%  0.25W
R7 R16 R17 R23 R29 R50 R52-R60 = 10k: RES SMD 10K OHM 0.1% 1/4W 0805; Manufacturer: Panasonic; Manufacturer Part Number: ERJ-PB6B1002V; Resistance: 10kR; Max Power Dissipation: 250mW; Temperature Coefficient: 50ppm/°C; Supplier 1: Mouser; RoHS: Yes; Category: Chip SMD Resistors; Stock 1: 10409; Pricing 1: 1=0.27000, 10=0.19900, 50=0.15600, 100=0.09100, 1000=0.04700, 10000=0.03500 (USD); Case/Package: 0805; Case Code (Metric): 2012; Case Code (Imperial): 0805; Min Operating Temperature: -55°C; Max Operating Temperature: 155°C; Features: Automotive AEC-Q200; Packaging: Tape and Reel; Resistor Type: Thick Film; Number of Terminations: 2; Tolerance: 0.1%; Length: 0.079inch; Width: 0.049inch; Height - Seated (Max): 0.028inch; ComponentLink1URL: https://industrial.panasonic.com/cdbs/www-data/pdf/RDM0000/DMM0000COL5.pdf?src-supplier=Digi-Key; ComponentLink1Description: https://industrial.panasonic.com/cdbs/www-data/pdf/RDM0000/DMM0000COL5.pdf?src-supplier=Digi-Key; ComponentLink2URL: https://industrial.panasonic.com/sa/system/files/data/download/catalog/id_fixed-resistors_e_2.pdf?src-supplier=Digi-Key; ComponentLink2Description: https://industrial.panasonic.com/sa/system/files/data/download/catalog/id_fixed-resistors_e_2.pdf?src-supplier=Digi-Key; Supplier Part Number 1: 667-ERJ-PB6B1002V
R8-R10 R25 = 20k: BOURNS         3296P-1-203LF            TRIMMER, 25 TURN 20K; Tolerance: 10%; Resistance: 20kR; Number of Turns: 25; Power Rating: 500mW; Temperature Coefficient: 100ppm/°C; Supplier 1: Newark; Manufacturer: Bourns; Manufacturer Part Number: 3296P-1-203LF; RoHS: Yes; Category: Variable Resistors and Potentiometers; Stock 1: 729; Pricing 1: 100=1.67000, 500=1.31000 (USD); Mount: Through Hole,Panel,PCB; Weight: 0.03oz; Color: Blue; Min Operating Temperature: -55°C; Max Operating Temperature: 125°C; Package Quantity: 50; Packaging: Rail/Tube; Resistor Type: Cermet; Termination: Pin; Taper: Linear; Max Power Dissipation: 500mW; Series: 3296; Technology: CERMET; Resistance Tolerance: 10%; Length: 9.53mm; Width: 0.395inch; Height: 0.19inch; Depth: 11.55mm; Radiation Hardening: No; REACH SVHC: No SVHC; Military Standard: Not; Lead Free: Lead Free; RoHS Compliant: Yes; ComponentLink1URL: https://datasheet.ciiva.com/1570/3296-1570384.pdf?src-supplier=Newark; ComponentLink1Description: https://datasheet.ciiva.com/1570/3296-1570384.pdf?src-supplier=Newark; ComponentLink2URL: https://datasheet.ciiva.com/11832/0900766b8069ccf4-11832206.pdf?src-supplier=RSComponents; ComponentLink2Description: https://datasheet.ciiva.com/11832/0900766b8069ccf4-11832206.pdf?src-supplier=RSComponents; ComponentLink3URL: https://datasheet.ciiva.com/29190/447270-da-01-en-trimmer-tht3296p-1-203lf-20-k-0-5w-29190277.pdf?src-supplier=Conrad; ComponentLink3Description: https://datasheet.ciiva.com/29190/447270-da-01-en-trimmer-tht3296p-1-203lf-20-k-0-5w-29190277.pdf?src-supplier=Conrad; ComponentLink4URL: https://datasheet.ciiva.com/2158/3296-2158304.pdf?src-supplier=Digi-Key; ComponentLink4Description: https://datasheet.ciiva.com/2158/3296-2158304.pdf?src-supplier=Digi-Key; ComponentLink5URL: https://datasheet.ciiva.com/8088/3296-8088855.pdf?src-supplier=Avnet; ComponentLink5Description: https://datasheet.ciiva.com/8088/3296-8088855.pdf?src-supplier=Avnet; ComponentLink6URL: https://datasheet.ciiva.com/14173/ew3296-dat-e-14173049.pdf?src-supplier=Distrelec; ComponentLink6Description: https://datasheet.ciiva.com/14173/ew3296-dat-e-14173049.pdf?src-supplier=Distrelec; ComponentLink7URL: https://datasheet.ciiva.com/16715/70153578-16715724.pdf?src-supplier=Allied+Electronics; ComponentLink7Description: https://datasheet.ciiva.com/16715/70153578-16715724.pdf?src-supplier=Allied+Electronics; ComponentLink8URL: https://datasheet.ciiva.com/1131/1815117-1131230.pdf?src-supplier=Element14; ComponentLink8Description: https://datasheet.ciiva.com/1131/1815117-1131230.pdf?src-supplier=Element14
R11 R21 R27 R35 = 1kR: Resistor;  Thin Film;  Res 1 Kilohms;  Pwr-Rtg 0.25 W;  Tol 0.1%;  SMT;  0805; Manufacturer: TT IRC; Manufacturer Part Number: PFC-W0805LF-03-1001-B; Voltage Rating: 100V; Power Rating: 250mW; Temperature Coefficient: 25ppm/°C; Supplier 1: Mouser; RoHS: Yes; Category: Chip SMD Resistors; Stock 1: 8948; Pricing 1: 1=0.98000, 10=0.95500, 50=0.82700, 100=0.76400, 1000=0.50900, 10000=0.44600 (USD); Case/Package: 0805; Number of Pins: 2; Case Code (Imperial): 0805; Case Code (Metric): 2012; Size Code: 0805; Min Operating Temperature: -55°C; Max Operating Temperature: 150°C; Resistance: 1kR; Tolerance: 0.1%; Packaging: Tape and Reel; Package Quantity: 1000; Resistor Type: Thin Film; Termination: SMD/SMT; Voltage Rating (DC): 100V; Series: PFC; Construction: Rectangular; Resistance Tolerance: 0.1%; Length: 2.05mm; Width: 1.27mm; Height: 0.5mm; Depth: 1.27mm; REACH SVHC: No SVHC; Military Standard: Not; Lead Free: Lead Free; RoHS Compliant: Yes; ComponentLink1URL: https://datasheet.ciiva.com/26849/getdatasheetpartid-728507-26849970.pdf?src-supplier=Verical; ComponentLink1Description: https://datasheet.ciiva.com/26849/getdatasheetpartid-728507-26849970.pdf?src-supplier=Verical; ComponentLink2URL: https://datasheet.ciiva.com/8036/126955-8036106.pdf?src-supplier=Element14; ComponentLink2Description: https://datasheet.ciiva.com/8036/126955-8036106.pdf?src-supplier=Element14; ComponentLink3URL: https://datasheet.ciiva.com/16756/70061376-16756399.pdf?src-supplier=Allied+Electronics; ComponentLink3Description: https://datasheet.ciiva.com/16756/70061376-16756399.pdf?src-supplier=Allied+Electronics; Supplier Part Number 1: 66-PFC08LF1.0K-B
R12 R22 R30-R33 = 2.2KR: 2.2K ±0.1%  0.25W
R14 = 470KR: 470K ohms ± 0.1% 0.25W
R19 = 47KR: 47K ±0.1% 0.25W
R20 = 500k: BOURNS         3296Y-1-504LF            TRIMMER, 25 TURN 500K; Resistance: 500kR; Tolerance: 10%; Power Rating: 500mW; Voltage Rating: 300V; Number of Turns: 25; Temperature Coefficient: 100ppm/°C; Lead Diameter: 0.5mm; Supplier 1: Digi-Key; Manufacturer: Bourns; Manufacturer Part Number: 3296Y-1-504LF; RoHS: Yes; Category: Variable Resistors and Potentiometers; Stock 1: 290; Pricing 1: 1=2.41000, 10=2.11700, 25=1.89800, 50=1.82500, 100=1.75200, 250=1.67900, 500=1.38700, 1000=1.31400, 5000=1.09500 (USD); Mount: Through Hole,Panel,PCB; Weight: 0.03oz; Color: Blue; Min Operating Temperature: -55°C; Max Operating Temperature: 125°C; Package Quantity: 50; Packaging: Rail/Tube; Voltage Rating (DC): 300V; Resistor Type: Cermet; Termination: Pin; Taper: Linear; Max Power Dissipation: 500mW; Series: 3296; Technology: CERMET; Resistance Tolerance: 10%; Length: 9.53mm; Width: 0.19inch; Height: 0.395inch; Depth: 4.83mm; Radiation Hardening: No; REACH SVHC: No SVHC; Military Standard: Not; Lead Free: Lead Free; RoHS Compliant: Yes; ComponentLink1URL: https://datasheet.ciiva.com/11832/0900766b8069ccf4-11832260.pdf?src-supplier=RSComponents; ComponentLink1Description: https://datasheet.ciiva.com/11832/0900766b8069ccf4-11832260.pdf?src-supplier=RSComponents; ComponentLink2URL: https://datasheet.ciiva.com/29122/447312-da-01-en-trimmer-tht-3296y-1-504lf-500k-0-5w-29122395.pdf?src-supplier=Conrad; ComponentLink2Description: https://datasheet.ciiva.com/29122/447312-da-01-en-trimmer-tht-3296y-1-504lf-500k-0-5w-29122395.pdf?src-supplier=Conrad; ComponentLink3URL: https://datasheet.ciiva.com/2156/3296-2156913.pdf?src-supplier=Digi-Key; ComponentLink3Description: https://datasheet.ciiva.com/2156/3296-2156913.pdf?src-supplier=Digi-Key; ComponentLink4URL: https://datasheet.ciiva.com/1131/1815117-1131508.pdf?src-supplier=Element14; ComponentLink4Description: https://datasheet.ciiva.com/1131/1815117-1131508.pdf?src-supplier=Element14; ComponentLink5URL: https://datasheet.ciiva.com/3266/3296-3266550.pdf?src-supplier=Avnet; ComponentLink5Description: https://datasheet.ciiva.com/3266/3296-3266550.pdf?src-supplier=Avnet; ComponentLink6URL: https://datasheet.ciiva.com/20164/68-0300e-20164135.pdf?src-supplier=Rapid+Electronics; ComponentLink6Description: https://datasheet.ciiva.com/20164/68-0300e-20164135.pdf?src-supplier=Rapid+Electronics; ComponentLink7URL: https://datasheet.ciiva.com/16716/70153578-16716249.pdf?src-supplier=Allied+Electronics; ComponentLink7Description: https://datasheet.ciiva.com/16716/70153578-16716249.pdf?src-supplier=Allied+Electronics; ComponentLink8URL: https://datasheet.ciiva.com/30113/3296-30113148.pdf?src-supplier=Onlinecomponents.com; ComponentLink8Description: https://datasheet.ciiva.com/30113/3296-30113148.pdf?src-supplier=Onlinecomponents.com; ComponentLink9URL: https://datasheet.ciiva.com/32423/dabourns3296-data-e-32423743.pdf?src-supplier=Distrelec; ComponentLink9Description: https://datasheet.ciiva.com/32423/dabourns3296-data-e-32423743.pdf?src-supplier=Distrelec
R24 R34 R42 R47 = 1kR: Resistor;  Thin Film;  Res 1 Kilohms;  Pwr-Rtg 0.25 W;  Tol 0.1%;  SMT;  0805; Manufacturer: TT IRC; Manufacturer Part Number: PFC-W0805LF-03-1001-B; Power Rating: 250mW; Voltage Rating: 100V; Temperature Coefficient: 25ppm/°C; Supplier 1: Mouser; RoHS: Yes; Category: Chip SMD Resistors; Pricing 1: 1=0.98000, 10=0.95500, 50=0.82700, 100=0.76400, 1000=0.50900, 10000=0.44600 (USD); Case/Package: 0805; Case Code (Metric): 2012; Case Code (Imperial): 0805; Size Code: 0805; Min Operating Temperature: -55°C; Max Operating Temperature: 150°C; Package Quantity: 1000; Resistance: 1kR; Tolerance: 0.1%; Packaging: Tape and Reel; Resistor Type: Thin Film; Voltage Rating (DC): 100V; Series: PFC; Resistance Tolerance: 0.1%; Construction: Rectangular; Length: 2.05mm; Width: 1.27mm; Height: 0.5mm; Depth: 1.27mm; REACH SVHC: No SVHC; Military Standard: Not; Lead Free: Lead Free; RoHS Compliant: Yes; ComponentLink1URL: https://datasheet.ciiva.com/26849/getdatasheetpartid-728507-26849970.pdf?src-supplier=Verical; ComponentLink1Description: https://datasheet.ciiva.com/26849/getdatasheetpartid-728507-26849970.pdf?src-supplier=Verical; ComponentLink2URL: https://datasheet.ciiva.com/8036/126955-8036106.pdf?src-supplier=Element14; ComponentLink2Description: https://datasheet.ciiva.com/8036/126955-8036106.pdf?src-supplier=Element14; ComponentLink3URL: https://datasheet.ciiva.com/16756/70061376-16756399.pdf?src-supplier=Allied+Electronics; ComponentLink3Description: https://datasheet.ciiva.com/16756/70061376-16756399.pdf?src-supplier=Allied+Electronics; Supplier Part Number 1: 66-PFC08LF1.0K-B; Stock 1: 8948; Number of Pins: 2; Termination: SMD/SMT
R26 = 4.7M: Resistor SMD 4.7 MOhm  ±  1 % 1206, CRCW12064M70FKEA, Vishay; Resistance: 4.7MR; Power Rating: 250mW; Tolerance: 1%; Voltage Rating: 200V; Temperature Coefficient: 100ppm/°C; Supplier 1: Digi-Key; Manufacturer: Vishay; Manufacturer Part Number: CRCW12064M70FKEA; RoHS: Yes; Category: Chip SMD Resistors; Stock 1: 13706; Pricing 1: 1=0.10000, 10=0.08000, 100=0.03060, 1000=0.01346, 2500=0.01162 (USD); Case/Package: 1206; Number of Pins: 2; Weight: 0.000353oz; Case Code (Metric): 3216; Case Code (Imperial): 1206; Contact Plating: Tin; Min Operating Temperature: -55°C; Max Operating Temperature: 155°C; Packaging: Tape and Reel; Resistor Type: Thick Film; Package Quantity: 10; Number of Terminations: 2; Termination: SMD/SMT; Max Power Dissipation: 250mW; Voltage Rating (DC): 200V; Features: Automotive AEC-Q200; Series: CRCW; Technology: THICK FILM; Resistance Tolerance: 1%; Construction: Rectangular; Length: 3.2mm; Width: 0.063inch; Height: 0.55mm; Depth: 1.6mm; Radiation Hardening: No; REACH SVHC: Unknown; Military Standard: Not; Lead Free: Lead Free; RoHS Compliant: Yes; ComponentLink1URL: https://datasheet.ciiva.com/11811/0900766b80d98b5e-11811376.pdf?src-supplier=RSComponents; ComponentLink1Description: https://datasheet.ciiva.com/11811/0900766b80d98b5e-11811376.pdf?src-supplier=RSComponents; ComponentLink2URL: https://datasheet.ciiva.com/2497/dcrcwe3-2497009.pdf?src-supplier=Digi-Key; ComponentLink2Description: https://datasheet.ciiva.com/2497/dcrcwe3-2497009.pdf?src-supplier=Digi-Key; ComponentLink3URL: https://datasheet.ciiva.com/2497/dcrcwe3-2497010.pdf?src-supplier=Digi-Key; ComponentLink3Description: https://datasheet.ciiva.com/2497/dcrcwe3-2497010.pdf?src-supplier=Digi-Key; ComponentLink4URL: https://datasheet.ciiva.com/2497/dcrcwe3-2497011.pdf?src-supplier=Digi-Key; ComponentLink4Description: https://datasheet.ciiva.com/2497/dcrcwe3-2497011.pdf?src-supplier=Digi-Key; ComponentLink5URL: https://datasheet.ciiva.com/6074/1697337-6074135.pdf?src-supplier=Farnell; ComponentLink5Description: https://datasheet.ciiva.com/6074/1697337-6074135.pdf?src-supplier=Farnell; ComponentLink6URL: https://datasheet.ciiva.com/7843/1697337-7843431.pdf?src-supplier=Element14; ComponentLink6Description: https://datasheet.ciiva.com/7843/1697337-7843431.pdf?src-supplier=Element14; ComponentLink7URL: https://datasheet.ciiva.com/7843/1697337-7843432.pdf?src-supplier=Element14; ComponentLink7Description: https://datasheet.ciiva.com/7843/1697337-7843432.pdf?src-supplier=Element14; ComponentLink8URL: https://datasheet.ciiva.com/8896/dcrcwe3-8896296.pdf?src-supplier=Avnet; ComponentLink8Description: https://datasheet.ciiva.com/8896/dcrcwe3-8896296.pdf?src-supplier=Avnet; ComponentLink9URL: https://datasheet.ciiva.com/16894/dcrcwe3-16894747.pdf?src-supplier=Avnet+Europe; ComponentLink9Description: https://datasheet.ciiva.com/16894/dcrcwe3-16894747.pdf?src-supplier=Avnet+Europe; ComponentLink10URL: https://datasheet.ciiva.com/22706/1697337-22706301.pdf?src-supplier=Element14; ComponentLink10Description: https://datasheet.ciiva.com/22706/1697337-22706301.pdf?src-supplier=Element14; ComponentLink11URL: https://datasheet.ciiva.com/26316/fld-crcw-e3-data-en-26316494.pdf?src-supplier=Distrelec; ComponentLink11Description: https://datasheet.ciiva.com/26316/fld-crcw-e3-data-en-26316494.pdf?src-supplier=Distrelec; Supplier Part Number 1: 541-4.70MFCT-ND